# Altium schematic sheet SH4-CONTROLS.SchDoc: RC GimbDrive - Controls
size Letter; DrawnBy: Christopher Arjune; SheetNumber: 4; SheetTotal: 4
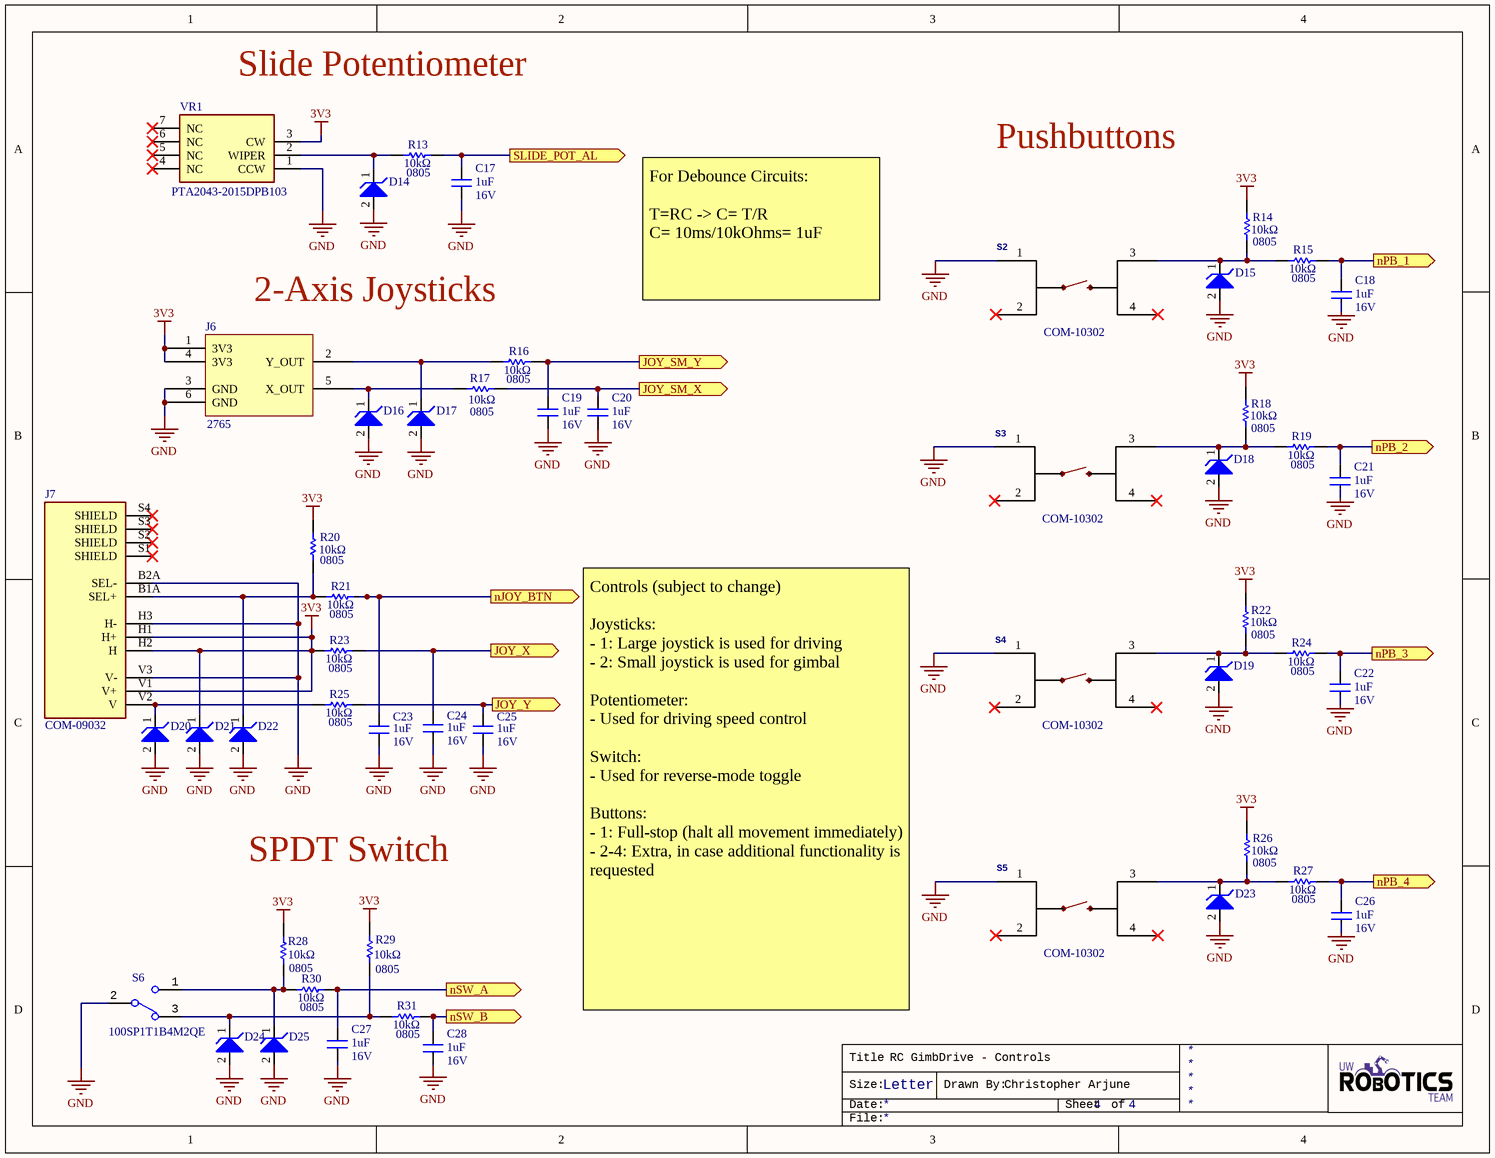
[diagram p0: SH4-CONTROLS.SchDoc]

## Parts
C17  value 1uF  Voltage Rating: 16V  [CAPC2012X140N]  (hidden comment: CAP_1uF_16V_0805)
C18  value 1uF  Voltage Rating: 16V  [CAPC2012X140N]  (hidden comment: CAP_1uF_16V_0805)
C19  value 1uF  Voltage Rating: 16V  [CAPC2012X140N]  (hidden comment: CAP_1uF_16V_0805)
C20  value 1uF  Voltage Rating: 16V  [CAPC2012X140N]  (hidden comment: CAP_1uF_16V_0805)
C21  value 1uF  Voltage Rating: 16V  [CAPC2012X140N]  (hidden comment: CAP_1uF_16V_0805)
C22  value 1uF  Voltage Rating: 16V  [CAPC2012X140N]  (hidden comment: CAP_1uF_16V_0805)
C23  value 1uF  Voltage Rating: 16V  [CAPC2012X140N]  (hidden comment: CAP_1uF_16V_0805)
C24  value 1uF  Voltage Rating: 16V  [CAPC2012X140N]  (hidden comment: CAP_1uF_16V_0805)
C25  value 1uF  Voltage Rating: 16V  [CAPC2012X140N]  (hidden comment: CAP_1uF_16V_0805)
C26  value 1uF  Voltage Rating: 16V  [CAPC2012X140N]  (hidden comment: CAP_1uF_16V_0805)
C27  value 1uF  Voltage Rating: 16V  [CAPC2012X140N]  (hidden comment: CAP_1uF_16V_0805)
C28  value 1uF  Voltage Rating: 16V  [CAPC2012X140N]  (hidden comment: CAP_1uF_16V_0805)
D14  TVS_DIODE_UNIDIR_3.3V  [SOD523]  (value not drawn)
D15  TVS_DIODE_UNIDIR_3.3V  [SOD523]  (value not drawn)
D16  TVS_DIODE_UNIDIR_3.3V  [SOD523]  (value not drawn)
D17  TVS_DIODE_UNIDIR_3.3V  [SOD523]  (value not drawn)
D18  TVS_DIODE_UNIDIR_3.3V  [SOD523]  (value not drawn)
D19  TVS_DIODE_UNIDIR_3.3V  [SOD523]  (value not drawn)
D20  TVS_DIODE_UNIDIR_3.3V  [SOD523]  (value not drawn)
D21  TVS_DIODE_UNIDIR_3.3V  [SOD523]  (value not drawn)
D22  TVS_DIODE_UNIDIR_3.3V  [SOD523]  (value not drawn)
D23  TVS_DIODE_UNIDIR_3.3V  [SOD523]  (value not drawn)
D24  TVS_DIODE_UNIDIR_3.3V  [SOD523]  (value not drawn)
D25  TVS_DIODE_UNIDIR_3.3V  [SOD523]  (value not drawn)
J6  Manufacturer Part Number 1: 2765  [2_AXIS_JOY_SMALL]  (hidden comment: 2_AXIS_JOYSTICK_SMALL)
J7  Manufacturer Part Number 1: COM-09032  [2_AXIS_JOY]  (hidden comment: 2_AXIS_JOYSTICK)
R13  value 10kΩ  Case Code (Imperial): 0805  [RESC2012X60N]  (hidden comment: RES_10kΩ_0805)
R14  value 10kΩ  Case Code (Imperial): 0805  [RESC2012X60N]  (hidden comment: RES_10kΩ_0805)
R15  value 10kΩ  Case Code (Imperial): 0805  [RESC2012X60N]  (hidden comment: RES_10kΩ_0805)
R16  value 10kΩ  Case Code (Imperial): 0805  [RESC2012X60N]  (hidden comment: RES_10kΩ_0805)
R17  value 10kΩ  Case Code (Imperial): 0805  [RESC2012X60N]  (hidden comment: RES_10kΩ_0805)
R18  value 10kΩ  Case Code (Imperial): 0805  [RESC2012X60N]  (hidden comment: RES_10kΩ_0805)
R19  value 10kΩ  Case Code (Imperial): 0805  [RESC2012X60N]  (hidden comment: RES_10kΩ_0805)
R20  value 10kΩ  Case Code (Imperial): 0805  [RESC2012X60N]  (hidden comment: RES_10kΩ_0805)
R21  value 10kΩ  Case Code (Imperial): 0805  [RESC2012X60N]  (hidden comment: RES_10kΩ_0805)
R22  value 10kΩ  Case Code (Imperial): 0805  [RESC2012X60N]  (hidden comment: RES_10kΩ_0805)
R23  value 10kΩ  Case Code (Imperial): 0805  [RESC2012X60N]  (hidden comment: RES_10kΩ_0805)
R24  value 10kΩ  Case Code (Imperial): 0805  [RESC2012X60N]  (hidden comment: RES_10kΩ_0805)
R25  value 10kΩ  Case Code (Imperial): 0805  [RESC2012X60N]  (hidden comment: RES_10kΩ_0805)
R26  value 10kΩ  Case Code (Imperial): 0805  [RESC2012X60N]  (hidden comment: RES_10kΩ_0805)
R27  value 10kΩ  Case Code (Imperial): 0805  [RESC2012X60N]  (hidden comment: RES_10kΩ_0805)
R28  value 10kΩ  Case Code (Imperial): 0805  [RESC2012X60N]  (hidden comment: RES_10kΩ_0805)
R29  value 10kΩ  Case Code (Imperial): 0805  [RESC2012X60N]  (hidden comment: RES_10kΩ_0805)
R30  value 10kΩ  Case Code (Imperial): 0805  [RESC2012X60N]  (hidden comment: RES_10kΩ_0805)
R31  value 10kΩ  Case Code (Imperial): 0805  [RESC2012X60N]  (hidden comment: RES_10kΩ_0805)
S2  Manufacturer Part Number 1: COM-10302  [TACTILE_SWITCH_PTH_12MM]  (hidden comment: Pushbutton)
S3  Manufacturer Part Number 1: COM-10302  [TACTILE_SWITCH_PTH_12MM]  (hidden comment: Pushbutton)
S4  Manufacturer Part Number 1: COM-10302  [TACTILE_SWITCH_PTH_12MM]  (hidden comment: Pushbutton)
S5  Manufacturer Part Number 1: COM-10302  [TACTILE_SWITCH_PTH_12MM]  (hidden comment: Pushbutton)
S6  SW_SPDT  [100SP1T1B4M2QE]  (value not drawn)
VR1  Manufacturer Part Number 1: PTA2043-2015DPB103  [PTA20432015CPB103]  (hidden comment: POT_10K_SLIDE)

## Ports
JOY_SM_X (out), JOY_SM_Y (out), JOY_X (out), JOY_Y (out), nJOY_BTN (out), nPB_1 (out), nPB_2 (out), nPB_3 (out), nPB_4 (out), nSW_A (out), nSW_B (out), SLIDE_POT_AL (out)

## Nets
3V3: D21.1 J6.1(3V3) J6.4(3V3) J7.H1(H+) J7.H2(H) J7.V1(V+) R14.1 R18.1 R20.1 R22.1 R23.1 R26.1 R28.1 R29.1 VR1.3(CW)
GND: C17.1 C18.1 C19.1 C20.1 C21.1 C22.1 C23.1 C24.1 C25.1 C26.1 C27.1 C28.1 D14.2 D15.2 D16.2 D17.2 D18.2 D19.2 D20.2 D21.2 D22.2 D23.2 D24.2 D25.2 J6.3(GND) J6.6(GND) J7.B2A(SEL-) J7.H3(H-) J7.V3(V-) S2.1 S3.1 S4.1 S5.1 S6.2 VR1.1(CCW)
JOY_SM_X: C20.2 R17.2 ; port JOY_SM_X
JOY_SM_Y: C19.2 R16.2 ; port JOY_SM_Y
JOY_X: C24.2 R23.2 ; port JOY_X
JOY_Y: C25.2 R25.2 ; port JOY_Y
nJOY_BTN: C23.2 R21.2 ; port nJOY_BTN
nPB_1: C18.2 R15.2 ; port nPB_1
nPB_2: C21.2 R19.2 ; port nPB_2
nPB_3: C22.2 R24.2 ; port nPB_3
nPB_4: C26.2 R27.2 ; port nPB_4
nSW_A: C27.2 R30.2 ; port nSW_A
nSW_B: C28.2 R31.2 ; port nSW_B
SLIDE_POT_AL: C17.2 R13.2 ; port SLIDE_POT_AL
NetD14_1: D14.1 R13.1 VR1.2(WIPER)
NetD15_1: D15.1 R14.2 R15.1 S2.3
NetD16_1: D16.1 J6.5(X_OUT) R17.1
NetD17_1: D17.1 J6.2(Y_OUT) R16.1
NetD18_1: D18.1 R18.2 R19.1 S3.3
NetD19_1: D19.1 R22.2 R24.1 S4.3
NetD20_1: D20.1 J7.V2(V) R25.1
NetD22_1: D22.1 J7.B1A(SEL+) R20.2 R21.1
NetD23_1: D23.1 R26.2 R27.1 S5.3
NetD24_1: D24.1 R29.2 R31.1 S6.3
NetD25_1: D25.1 R28.2 R30.1 S6.1

Not connected (* = marked no-connect by the designer): J7 S1(SHIELD)* S2(SHIELD)* S3(SHIELD)* S4(SHIELD)*; S2 2* 4*; S3 2* 4*; S4 2* 4*; S5 2* 4*; VR1 4(NC)* 5(NC)* 6(NC)* 7(NC)*

## Notes on the sheet
- (near VR1) Slide Potentiometer
- Pushbuttons
- For Debounce Circuits:
  T=RC -> C= T/R
  C= 10ms/10kOhms= 1uF
- 2-Axis Joysticks
- SPDT Switch
- Controls (subject to change)
  Joysticks:
  - 1: Large joystick is used for driving
  - 2: Small joystick is used for gimbal
  Potentiometer:
  - Used for driving speed control
  Switch:
  - Used for reverse-mode toggle
  Buttons:
  - 1: Full-stop (halt all movement immediately)
  - 2-4: Extra, in case additional functionality is requested
- Title
- Size:
- Date:
- Letter
- Drawn By:
- Sheet
- of
- File:

## Library data of the parts
C17-C28 = CAP_1uF_16V_0805: CAP CER 1UF 16V X7R 0805; Manufacturer 1: Yageo; Manufacturer Part Number 1: CC0805KKX7R7BB105; Tolerance: 10%; Mount: Surface Mount; Case Code (Metric): 2012; Case Code (Imperial): 0805; Min Operating Temperature: -55°C; Max Operating Temperature: 125°C; Dielectric: X7R; Termination: SMD/SMT; Supplier 1: Digi-Key; Supplier Part Number 1: 311-1365-1-ND; Package: 0805 (2012 Metric)
D14-D25 = TVS_DIODE_UNIDIR_3.3V: TVS DIODE 3.3V 14.1V SOD523. Used to protect each connector input line going into the MCU.; Manufacturer 1: ON Semiconductor; Manufacturer Part Number 1: ESD5Z3.3T1G; Reverse Breakdown Voltage: 5V; Peak Pulse Power: 158W; Power Line Protection: No; Number of Channels: 1; Polarity: Unidirectional; Peak Pulse Current: 11.2A; Supplier 1: Digi-Key; Mount: Surface Mount; Number of Pins: 2; Min Operating Temperature: -55°C; Max Operating Temperature: 150°C; Reverse Standoff Voltage: 3.3V; Clamping Voltage: 14.1V; Composition: Zener; Supplier Part Number 1: ESD5Z3.3T1GOSCT-ND
J6 = 2_AXIS_JOYSTICK_SMALL: JOYSTICK 10K OHM 2 AXIS TH; Manufacturer 1: Adafruit Industries; Resistance: 10kR; Supplier 1: Digi-Key; Stock 1: 351; Pricing 1: 1=2.50000 (USD); RoHS: Yes; Mount: Through Hole; Packaging: Bulk; Length: 0.707inch; Height: 0.472inch; Width: 0.697inch; ComponentLink1URL: https://media.digikey.com/pdf/Data%20Sheets/Adafruit%20PDFs/2765_Web.pdf?src-supplier=Digi-Key; ComponentLink1Description: https://media.digikey.com/pdf/Data%20Sheets/Adafruit%20PDFs/2765_Web.pdf?src-supplier=Digi-Key; Supplier Part Number 1: 1528-1730-ND
J7 = 2_AXIS_JOYSTICK: JOYSTICK 10K OHM 2 AXIS TH; Manufacturer 1: SparkFun; Supplier 1: Digi-Key; Stock 1: 1039; Pricing 1: 1=3.95000 (USD); RoHS: No; ComponentLink1URL: https://media.digikey.com/pdf/Data%20Sheets/Sparkfun%20PDFs/COM-09032_Web.pdf?src-supplier=Digi-Key; ComponentLink1Description: https://media.digikey.com/pdf/Data%20Sheets/Sparkfun%20PDFs/COM-09032_Web.pdf?src-supplier=Digi-Key; Supplier Part Number 1: 1568-1526-ND
R13-R31 = RES_10kΩ_0805: RES SMD 10K OHM 1% 1/8W 0805; Manufacturer 1: Yageo; Manufacturer Part Number 1: RC0805FR-0710KL; Power Rating: 125mW; Supplier 1: Digi-Key; Case Code (Metric): 2012; Min Operating Temperature: -55°C; Max Operating Temperature: 155°C; Resistance: 10K; Tolerance: 1%; Termination: SMD/SMT; Supplier Part Number 1: 311-10.0KCRCT-ND; Package: 0805 (2012 Metric)
S2-S5 = MOMENTARY_SWITCH_TH: Momentary Switch (Pushbutton) - SPST; Manufacturer 1: SparkFun; SymbolName_1: SWITCH-MOMENTARY-2; PROD_ID: SWCH-09185; SF_SKU: COM-09190; Package: TACTILE_SWITCH_PTH_12MM; Supplier 1: Digi-Key; Stock 1: 32; Pricing 1: 1=5.85000 (USD); RoHS: No; Mount: Through Hole; Throw Configuration: SPST; Termination: PC Pin; ComponentLink1URL: https://www.sparkfun.com/datasheets/Components/Buttons/TSA12110%20TACT%20SWITCH.jpg?src-supplier=Digi-Key; ComponentLink1Description: https://www.sparkfun.com/datasheets/Components/Buttons/TSA12110%20TACT%20SWITCH.jpg?src-supplier=Digi-Key; Supplier Part Number 1: 1568-1332-ND
S6 = SW_SPDT: SWITCH TOGGLE SPDT 5A 120V; Manufacturer 1: E-Switch; Actuator Material: Brass,Chrome; Switch Function: On-On; Voltage Rating (DC): 28V; Illumination Type: Non-Illuminated,Illuminated; Actuator Type: Standard Round; Electrical Life: 40000Cycles; Actuator Length: 12.19mm; ComponentLink1URL: https://datasheet.ciiva.com/24455/t111597-24455739.pdf?src-supplier=Onlinecomponents.com; ComponentLink1Description: https://datasheet.ciiva.com/24455/t111597-24455739.pdf?src-supplier=Onlinecomponents.com; ComponentLink2URL: https://datasheet.ciiva.com/2905/t111597-2905494.pdf?src-supplier=Digi-Key; ComponentLink2Description: https://datasheet.ciiva.com/2905/t111597-2905494.pdf?src-supplier=Digi-Key; Supplier 1: Digi-Key; Manufacturer Part Number 1: 100SP1T1B4M2QE; Stock 1: 4845; Pricing 1: 1=1.99000, 10=1.77900, 25=1.68240, 50=1.60200, 100=1.52950, 250=1.46512, 500=1.36850, 1000=1.30410 (USD); RoHS: Yes; Mount: Through Hole; Contact Material: Silver; Contact Plating: Silver; Min Operating Temperature: -30°C; Max Operating Temperature: 85°C; Package Quantity: 1; Current Rating: 5A; Voltage Rating (AC): 120V; Packaging: Bulk; Orientation: Vertical; Termination: PC Pin; Throw Configuration: SPDT; Lead Free: Lead Free; Supplier Part Number 1: EG2355-ND
VR1 = POT_10K_SLIDE: SLIDE POT 10K OHM 0.1W TOP 20MM; Manufacturer 1: Bourns; Max Power Dissipation: 100mW; Tolerance: 20%; Resistance: 10kR; Power Rating: 50mW; Number of Turns: 1; Hole Diameter: 1.2mm; Supplier 1: Digi-Key; Stock 1: 927; Pricing 1: 1=1.29000, 10=1.14000, 25=1.02600, 50=0.98800, 100=0.95000, 250=0.89300, 500=0.76000, 1000=0.70300, 5000=0.57760 (USD); RoHS: Yes; Mount: Through Hole; Min Operating Temperature: -10°C; Max Operating Temperature: 50°C; Packaging: Bulk; Composition: Potentiometer; Type: Potentiometer; Termination: Pin; Taper: Linear; Military Standard: Not; Package Quantity: 100; Length: 35mm; Height: 0.256inch; Width: 0.354inch; Depth: 9mm; ComponentLink1URL: https://datasheet.ciiva.com/6248/pta-6248511.pdf?src-supplier=Digi-Key; ComponentLink1Description: https://datasheet.ciiva.com/6248/pta-6248511.pdf?src-supplier=Digi-Key; Supplier Part Number 1: PTA2043-2015DPB103-ND; Radiation Hardening: No